# Altium schematic sheet 05_Uart_Bluetooth.SchDoc
size A3; SheetNumber: 4; SheetTotal: 5
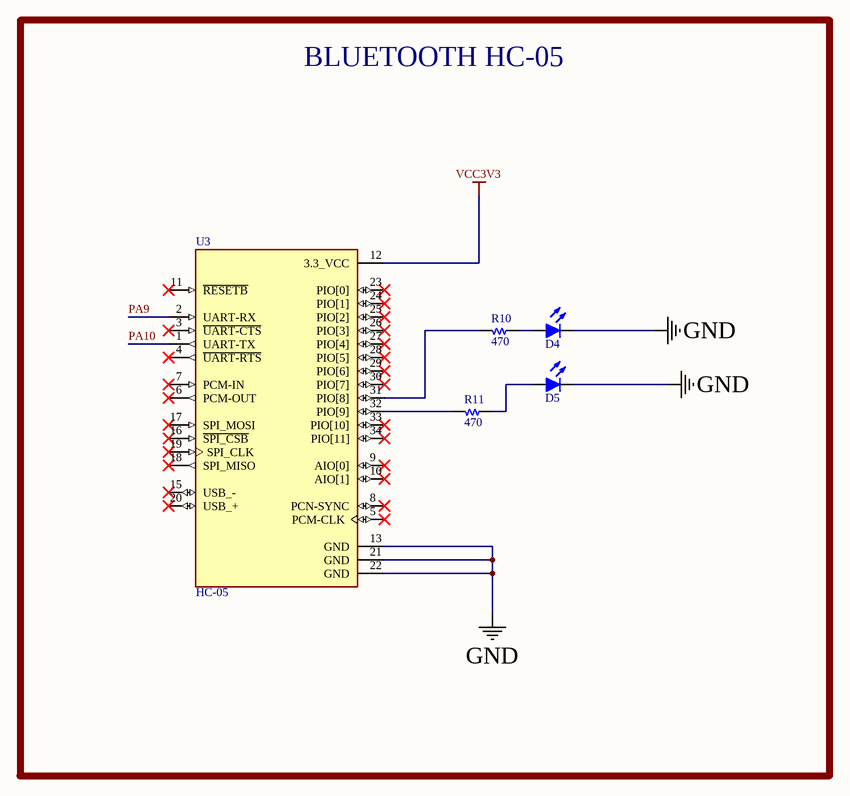
[diagram p0: 05_Uart_Bluetooth.SchDoc]

## Parts
D4  Led  [Led 0805]  (value not drawn)
D5  Led  [Led 0805]  (value not drawn)
R10  470  [R 0805]
R11  470  [R 0805]
U3  HC-05  [XCVR_HC-05]

## Blocks framed on the sheet
BLUETOOTH HC-05: D4 D5 R10 R11 U3

## Nets
GND: D4.2(K) D5.2(K) U3.13(GND) U3.21(GND) U3.22(GND)
VCC3V3: U3.12(3.3_VCC)
PA9: U3.2(UART-RX)
PA10: U3.1(UART-TX)
NetD4_1: D4.1(A) R10.1
NetD5_1: D5.1(A) R11.1
NetR10_2: R10.2 U3.31(PIO[8])
NetR11_2: R11.2 U3.32(PIO[9])

Not connected (* = marked no-connect by the designer): U3 3(~{UART-CTS})* 4(~{UART-RTS})* 5(PCM-CLK)* 6(PCM-OUT)* 7(PCM-IN)* 8(PCN-SYNC)* 9(AIO[0])* 10(AIO[1])* 11(~{RESETB})* 15(USB_-)* 16(~{SPI_CSB})* 17(SPI_MOSI)* 18(SPI_MISO)* 19(SPI_CLK)* 20(USB_+)* 23(PIO[0])* 24(PIO[1])* 25(PIO[2])* 26(PIO[3])* 27(PIO[4])* 28(PIO[5])* 29(PIO[6])* 30(PIO[7])* 33(PIO[10])* 34(PIO[11])*

## Library data of the parts
D4 D5 = Led: Typical LED
R10 R11 = Resistor
U3 = HC-05: Bluetooth to Serial Port Module; MP: HC-05; Value: *; Price: None; Package: None; Availability: Unavailable